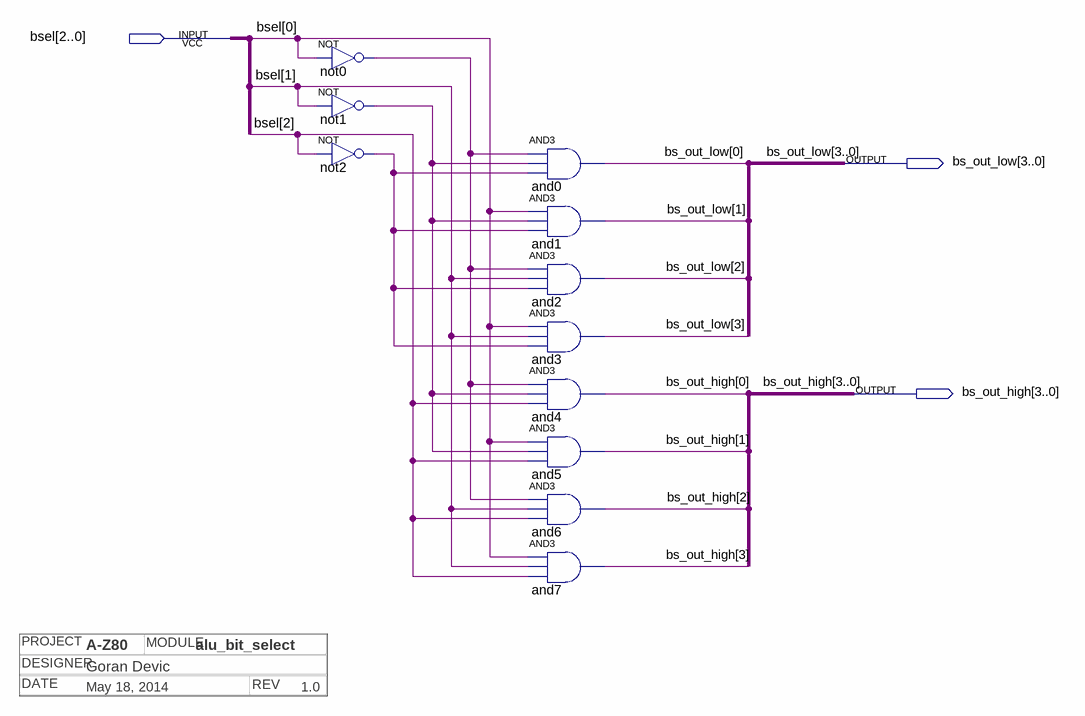
[diagram p0: schematic sheet]
// Quartus schematic alu_bit_select.bdf as structural Verilog: 11 symbols, 3 pins
// Title block: PROJECT: A-Z80; MODULE: alu_bit_select; DESIGNER: Goran Devic; DATE: May 18, 2014; REV: 1.0
module alu_bit_select (
  input  [2:0] bsel,
  output [3:0] bs_out_low,
  output [3:0] bs_out_high
);

  wire not0_out, not1_out, not2_out;

  not not0 (not0_out, bsel[0]);
  not not1 (not1_out, bsel[1]);
  not not2 (not2_out, bsel[2]);
  and and0 (bs_out_low[0], not0_out, not1_out, not2_out);
  and and1 (bs_out_low[1], bsel[0], not1_out, not2_out);
  and and2 (bs_out_low[2], not0_out, bsel[1], not2_out);
  and and3 (bs_out_low[3], bsel[0], bsel[1], not2_out);
  and and4 (bs_out_high[0], not0_out, not1_out, bsel[2]);
  and and5 (bs_out_high[1], bsel[0], not1_out, bsel[2]);
  and and6 (bs_out_high[2], not0_out, bsel[1], bsel[2]);
  and and7 (bs_out_high[3], bsel[0], bsel[1], bsel[2]);
endmodule
